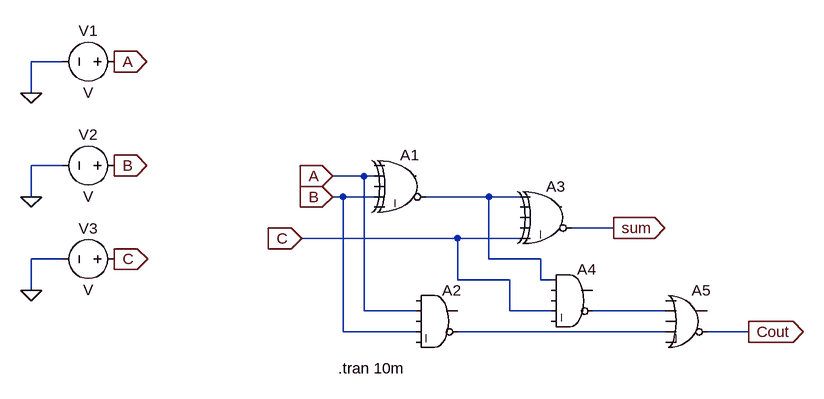
[diagram p0: schematic FullAdder.asc]
FullAdder.asc, the LTspice schematic file:
Version 4
SHEET 1 1008 680
WIRE -160 -48 -208 -48
WIRE -208 0 -208 -48
WIRE -160 112 -208 112
WIRE 304 128 256 128
WIRE 320 128 304 128
WIRE -208 160 -208 112
WIRE 272 160 256 160
WIRE 320 160 272 160
WIRE 496 160 400 160
WIRE 544 160 496 160
WIRE 688 208 624 208
WIRE 448 224 208 224
WIRE 544 224 448 224
WIRE -160 256 -208 256
WIRE 496 256 496 160
WIRE 576 256 496 256
WIRE 448 288 448 224
WIRE 528 288 448 288
WIRE 576 288 576 256
WIRE 592 288 576 288
WIRE -208 304 -208 256
WIRE 304 336 304 128
WIRE 384 336 304 336
WIRE 528 336 528 288
WIRE 592 336 528 336
WIRE 768 336 656 336
WIRE 272 368 272 160
WIRE 384 368 272 368
WIRE 768 368 448 368
WIRE 896 368 832 368
FLAG 256 128 A
IOPIN 256 128 In
FLAG 256 160 B
IOPIN 256 160 In
FLAG -80 -48 A
IOPIN -80 -48 Out
FLAG -80 112 B
IOPIN -80 112 Out
FLAG -80 256 C
IOPIN -80 256 Out
FLAG -208 0 0
FLAG -208 160 0
FLAG -208 304 0
FLAG 208 224 C
IOPIN 208 224 In
FLAG 688 208 sum
IOPIN 688 208 Out
FLAG 896 368 Cout
IOPIN 896 368 Out
SYMBOL Digital\\xor 368 80 R0
SYMATTR InstName A1
SYMBOL Digital\\and 416 288 R0
SYMATTR InstName A2
SYMBOL voltage -64 -48 R90
WINDOW 0 -32 56 VBottom 2
WINDOW 3 32 56 VTop 2
SYMATTR InstName V1
SYMBOL voltage -64 112 R90
WINDOW 0 -32 56 VBottom 2
WINDOW 3 32 56 VTop 2
SYMATTR InstName V2
SYMBOL voltage -64 256 R90
WINDOW 0 -32 56 VBottom 2
WINDOW 3 32 56 VTop 2
SYMATTR InstName V3
SYMBOL Digital\\xor 592 128 R0
SYMATTR InstName A3
SYMBOL Digital\\and 624 256 R0
SYMATTR InstName A4
SYMBOL Digital\\or 800 288 R0
SYMATTR InstName A5
TEXT 264 424 Left 2 !.tran 10m

The netlist it stands for:
* FullAdder.asc
A1 0 A 0 B 0 N001 0 0 XOR
A2 0 A 0 B 0 N003 0 0 AND
V1 A 0 V
V2 B 0 V
V3 C 0 V
A3 N001 0 0 0 C sum 0 0 XOR
A4 N001 0 0 C 0 N002 0 0 AND
A5 0 N002 0 N003 0 Cout 0 0 OR
.tran 10m
.backanno
.end